# Altium project A1_v31.PrjPcb
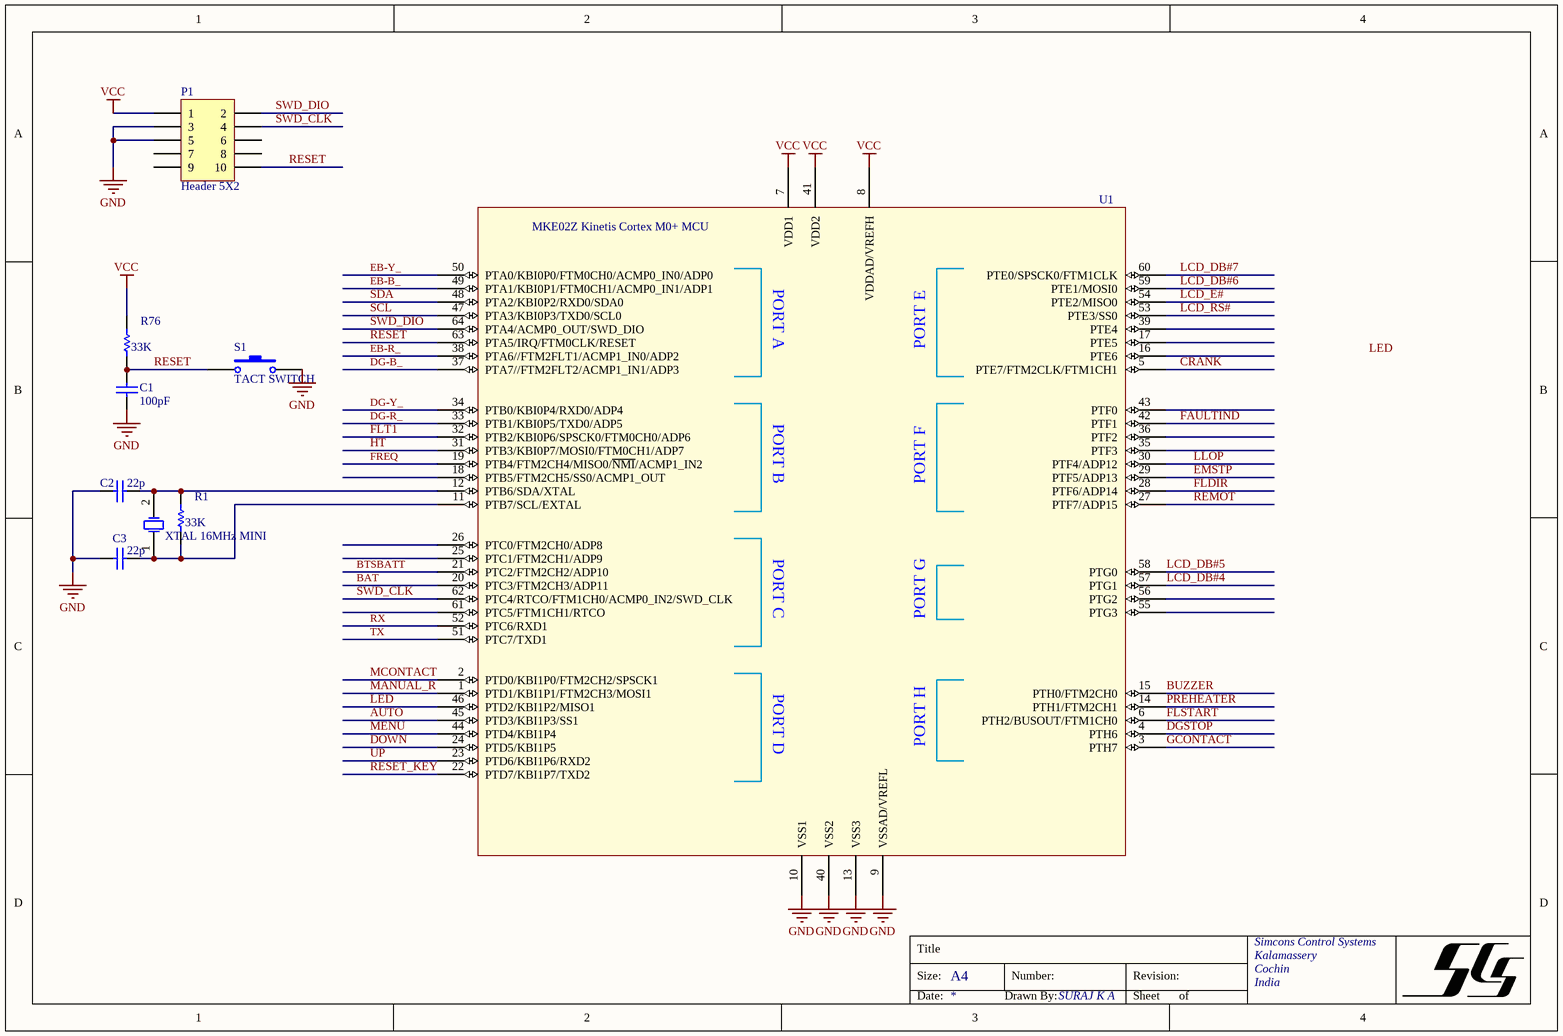
[diagram p0: arm_mcu.SchDoc]
4 sheets, 46 parts. Net scope: global (net labels, ports and power ports of the same name join across sheets).
Board file: A1_v31.PcbDoc
Sheets:
  arm_mcu.SchDoc
  DigitalIO.SchDoc
  PROCESSORv31.SchDoc
  IO_v31.SchDoc

## Sheet arm_mcu.SchDoc
size A4; Author: Suraj; DrawnBy: Suraj; Engineer: Suraj; Organization: Simcons Control Systems; Address1: Kalamassery; Address2: Cochin; Address4: India

### Parts
C1  value 100pF  [C1206_W]  (hidden comment: .1uF 1206)
C2  value 22p  [C1206_W]  (hidden comment: 22pF 1206)
C3  value 22p  [C1206_W]  (hidden comment: 22pF 1206)
P1  Header 5X2  [HDR2X5]
R1  value 33K  [R1206_W]  (hidden comment: 100K 1206)
R76  value 33K  [R1206_W]  (hidden comment: 100K 1206)
S1  TACT SWITCH  [SWSMALL]
U1  MKE02Z Kinetis Cortex M0+ MCU  [PLQP0064GA-A_M]
Y1  XTAL 16MHz MINI  [XTAL]

### Nets
GND: C1.1 C2.1 C3.1 P1.3 P1.5 S1.2 U1.9(VSSAD/VREFL) U1.10(VSS1) U1.13(VSS3) U1.40(VSS2)
VCC: P1.1 R76.1 U1.7(VDD1) U1.8(VDDAD/VREFH) U1.41(VDD2)
AUTO: U1.45(PTD3/KBI1P3/SS1)
BAT: U1.20(PTC3/FTM2CH3/ADP11)
BTSBATT: U1.21(PTC2/FTM2CH2/ADP10)
BUZZER: U1.15(PTH0/FTM2CH0)
CRANK: U1.5(PTE7/FTM2CLK/FTM1CH1)
DG-B_: U1.37(PTA7//FTM2FLT2/ACMP1_IN1/ADP3)
DG-R_: U1.33(PTB1/KBI0P5/TXD0/ADP5)
DG-Y_: U1.34(PTB0/KBI0P4/RXD0/ADP4)
DGSTOP: U1.4(PTH6)
DOWN: U1.24(PTD5/KBI1P5)
EB-B_: U1.49(PTA1/KBI0P1/FTM0CH1/ACMP0_IN1/ADP1)
EB-R_: U1.38(PTA6//FTM2FLT1/ACMP1_IN0/ADP2)
EB-Y_: U1.50(PTA0/KBI0P0/FTM0CH0/ACMP0_IN0/ADP0)
EMSTP: U1.29(PTF5/ADP13)
FAULTIND: U1.42(PTF1)
FLDIR: U1.28(PTF6/ADP14)
FLSTART: U1.6(PTH2/BUSOUT/FTM1CH0)
FLT1: U1.32(PTB2/KBI0P6/SPSCK0/FTM0CH0/ADP6)
FREQ: U1.19(PTB4/FTM2CH4/MISO0/~{NMI}/ACMP1_IN2)
GCONTACT: U1.3(PTH7)
HT: U1.31(PTB3/KBI0P7/MOSI0/FTM0CH1/ADP7)
LCD_DB#4: U1.57(PTG1)
LCD_DB#5: U1.58(PTG0)
LCD_DB#6: U1.59(PTE1/MOSI0)
LCD_DB#7: U1.60(PTE0/SPSCK0/FTM1CLK)
LCD_E#: U1.54(PTE2/MISO0)
LCD_RS#: U1.53(PTE3/SS0)
LED: U1.46(PTD2/KBI1P2/MISO1)
LLOP: U1.30(PTF4/ADP12)
MANUAL_R: U1.1(PTD1/KBI1P1/FTM2CH3/MOSI1)
MCONTACT: U1.2(PTD0/KBI1P0/FTM2CH2/SPSCK1)
MENU: U1.44(PTD4/KBI1P4)
PREHEATER: U1.14(PTH1/FTM2CH1)
REMOT: U1.27(PTF7/ADP15)
RESET: C1.2 P1.10 R76.2 S1.1 U1.63(PTA5/IRQ/FTM0CLK/RESET)
RESET_KEY: U1.22(PTD7/KBI1P7/TXD2)
RX: U1.52(PTC6/RXD1)
SCL: U1.47(PTA3/KBI0P3/TXD0/SCL0)
SDA: U1.48(PTA2/KBI0P2/RXD0/SDA0)
SWD_CLK: P1.4 U1.62(PTC4/RTCO/FTM1CH0/ACMP0_IN2/SWD_CLK)
SWD_DIO: P1.2 U1.64(PTA4/ACMP0_OUT/SWD_DIO)
TX: U1.51(PTC7/TXD1)
UP: U1.23(PTD6/KBI1P6/RXD2)
NetC2_2: C2.2 R1.1 U1.12(PTB6/SDA/XTAL) Y1.2(OSC2)
NetC3_2: C3.2 R1.2 U1.11(PTB7/SCL/EXTAL) Y1.1(OSC1)

Not connected (* = marked no-connect by the designer): P1 6 7 8 9; U1 16(PTE6) 17(PTE5) 18(PTB5/FTM2CH5/SS0/ACMP1_OUT) 25(PTC1/FTM2CH1/ADP9) 26(PTC0/FTM2CH0/ADP8) 35(PTF3) 36(PTF2) 39(PTE4) 43(PTF0) 55(PTG3) 56(PTG2) 61(PTC5/FTM1CH1/RTCO)

### Notes on the sheet
- Labels drawn without touching a wire or pin: LED
- Title
- Size:
- A4
- Number:
- Revision:
- Simcons Control Systems
- Kalamassery
- Cochin
- India
- Date:
- Drawn By:
- SURAJ K A
- Sheet
- of
- (in symbol MKE02Z64) PORT A; PORT E; PORT B; PORT F; PORT C; PORT G; PORT D; PORT H

### Library data of the parts
C1-C3 = Cap: Capacitor; Published: 8-Jun-2000; LatestRevisionDate: 17-Jul-2002; LatestRevisionNote: Re-released for DXP Platform.; PackageReference: RAD-0.3; Publisher: Altium Limited; PackageDescription: Radial Cap, Thru-Hole; 2 Leads; 0.3 in Pin Spacing
P1 = Header 5X2: Header, 5-Pin, Dual row; LatestRevisionDate: 17-Jul-2002; LatestRevisionNote: Re-released for DXP Platform.; Publisher: Altium Limited
R1 R76 = Res1: Resistor; Published: 8-Jun-2000; LatestRevisionDate: 17-Jul-2002; LatestRevisionNote: Re-released for DXP Platform.; PackageReference: AXIAL-0.4; Publisher: Altium Limited; PackageDescription: Axial Device, Thru-Hole; 2 Leads; 0.3 in Pin Spacing
S1 = SW-PB: Switch; Published: 24-Mar-1999; LatestRevisionDate: 17-Jul-2002; LatestRevisionNote: Re-released for DXP Platform.; PackageReference: SPST-2; Publisher: Altium Limited; PackageDescription: Switch; 2 Leads
U1 = MKE02Z64: 32-Bit ARM Cortex M0+ RISC Core, 64KB Program Flash, 256B EEPROM, 4KB RAM, 64-Pin LQFP
Y1 = XTAL: Crystal Oscillator; Published: 8-Jun-2000; LatestRevisionDate: 17-Jul-2002; LatestRevisionNote: Re-released for DXP Platform.; PackageReference: R38; Publisher: Altium Limited; PackageDescription: Crystal, Thru-Hole; 2 Leads; Body 3.1 x 8.2 mm (Dia.xH)

## Sheet DigitalIO.SchDoc
size A4; Author: Suraj; DrawnBy: Suraj; Engineer: Suraj; Organization: Simcons Control Systems; Address1: Kalamassery; Address2: Cochin; Address4: India
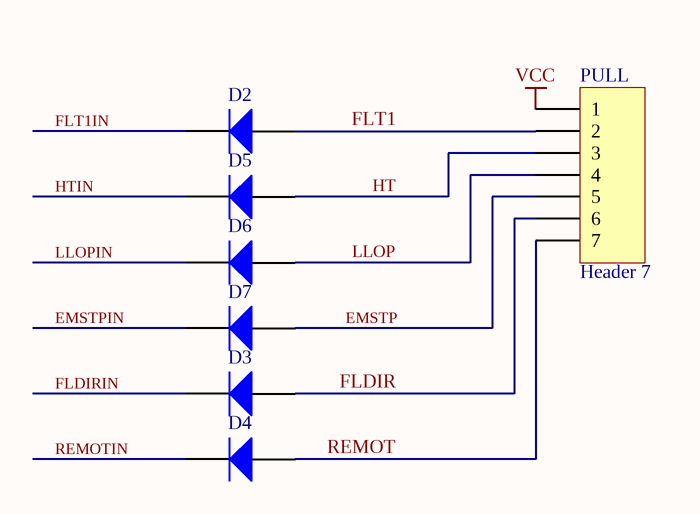
[diagram p1: DigitalIO.SchDoc]

### Parts
D2  Diode 1N4001  [4148SMD]  (value not drawn)
D3  Diode 1N4001  [4148SMD]  (value not drawn)
D4  Diode 1N4001  [4148SMD]  (value not drawn)
D5  Diode 1N4001  [4148SMD]  (value not drawn)
D6  Diode 1N4001  [4148SMD]  (value not drawn)
D7  Diode 1N4001  [4148SMD]  (value not drawn)
PULL  Header 7  [HDR1X7]

### Nets
VCC: PULL.1
EMSTP: D7.1(A) PULL.5
EMSTPIN: D7.2(K)
FLDIR: D3.1(A) PULL.6
FLDIRIN: D3.2(K)
FLT1: D2.1(A) PULL.2
FLT1IN: D2.2(K)
HT: D5.1(A) PULL.3
HTIN: D5.2(K)
LLOP: D6.1(A) PULL.4
LLOPIN: D6.2(K)
REMOT: D4.1(A) PULL.7
REMOTIN: D4.2(K)

### Notes on the sheet
- Title
- Size:
- A4
- Number:
- Revision:
- Simcons Control Systems
- Kalamassery
- Cochin
- India
- Date:
- Drawn By:
- SURAJ K A
- Sheet
- of

### Library data of the parts
D2-D7 = Diode 1N4001: 1 Amp General Purpose Rectifier; Published: 8-Jun-2000; LatestRevisionDate: 17-Jul-2002; LatestRevisionNote: Re-released for DXP Platform.; DatasheetVersion: 1998; PackageVersion: Aug-1999; PackageReference: DO-41; Publisher: Altium Limited; PackageDescription: Diode, Axial; Body 5.2 x 2.7 mm (LxDia. max), Lead Dia. 0.86 mm (max); Code_JEDEC: DO-204-AL; ComponentLink1Description: Manufacturer Link; ComponentLink1URL: http://www.fairchildsemi.com/; ComponentLink2Description: Datasheet; ComponentLink2URL: http://www.fairchildsemi.com/ds/1N%2F1N4001.pdf
PULL = Header 7: Header, 7-Pin; LatestRevisionDate: 17-Jul-2002; LatestRevisionNote: Re-released for DXP Platform.; Publisher: Altium Limited

## Sheet PROCESSORv31.SchDoc: AMF CONTROLLER GC12 v3.0
size A4; Date: MAR 2013; DrawnBy: SURAJ K A; Engineer: SURAJ K A; Revision: 310; SheetNumber: 1; SheetTotal: 2; DocumentName: AMFR
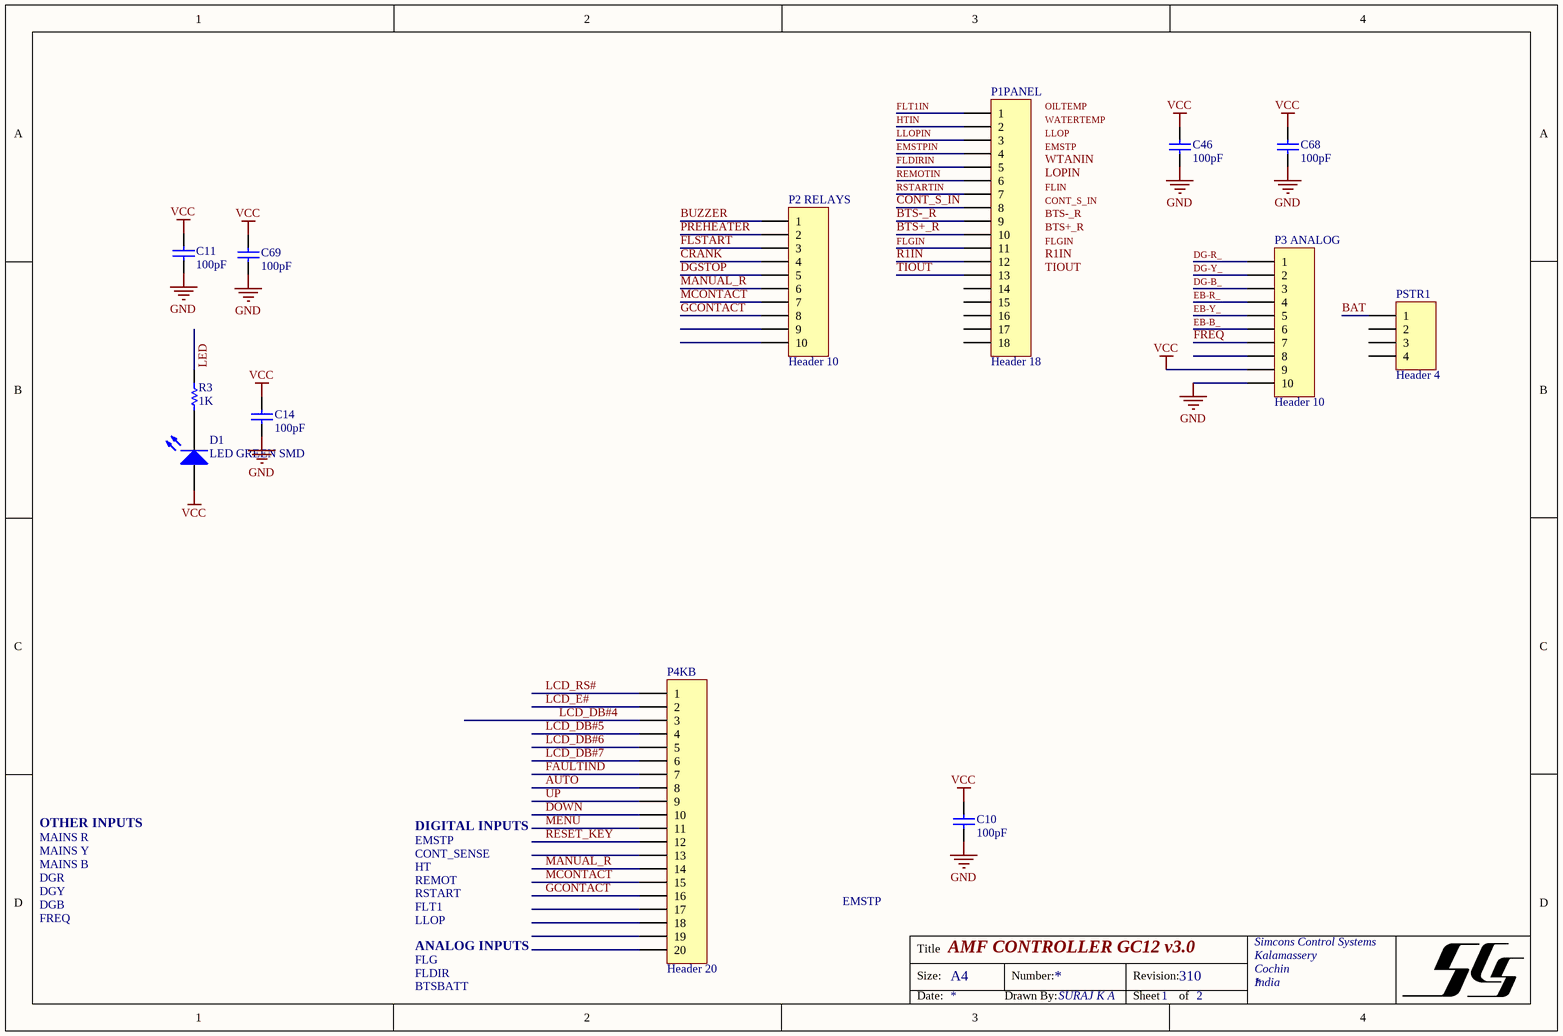
[diagram p2: PROCESSORv31.SchDoc]

### Parts
C10  value 100pF  [C1206_W]  (hidden comment: .1uF 1206)
C11  value 100pF  [C1206_W]  (hidden comment: 1uF 1206)
C14  value 100pF  [C1206_W]  (hidden comment: .1uF 1206)
C46  value 100pF  [C1206_W]  (hidden comment: .1uF 1206)
C68  value 100pF  [Cap_.1]  (hidden comment: 100uF/25V)
C69  value 100pF  [C1206_W]  (hidden comment: .1uF 1206)
D1  LED GREEN SMD  [LED SMD]
P1PANEL  Header 18  [HDR1X18_BURGE_F]
P2_RELAYS  Header 10  [HDR1X10_BURGE_F]
P3_ANALOG  Header 10  [HDR1X10_BURGE_F]
P4KB  Header 20  [HDR1X20_BURGE_F]
PSTR1  Header 4  [HDR1X4_BURGE_F]
R3  value 1K  [R1206_W]  (hidden comment: 1K 1206)

### Nets
GND: C10.1 C11.1 C14.1 C46.1 C68.2 C69.1 P3_ANALOG.10
VCC: C10.2 C11.2 C14.2 C46.2 C68.1 C69.2 D1.1(A) P3_ANALOG.9
AUTO: P4KB.8
BAT: PSTR1.1
BTS+_R: P1PANEL.10
BTS-_R: P1PANEL.9
BUZZER: P2_RELAYS.1
CONT_S_IN: P1PANEL.8
CRANK: P2_RELAYS.4
DG-B_: P3_ANALOG.3
DG-R_: P3_ANALOG.1
DG-Y_: P3_ANALOG.2
DGSTOP: P2_RELAYS.5
DOWN: P4KB.10
EB-B_: P3_ANALOG.6
EB-R_: P3_ANALOG.4
EB-Y_: P3_ANALOG.5
EMSTPIN: P1PANEL.4
FAULTIND: P4KB.7
FLDIRIN: P1PANEL.5
FLGIN: P1PANEL.11
FLSTART: P2_RELAYS.3
FLT1IN: P1PANEL.1
FREQ: P3_ANALOG.7
GCONTACT: P2_RELAYS.8 P4KB.16
HTIN: P1PANEL.2
LCD_DB#4: P4KB.3
LCD_DB#5: P4KB.4
LCD_DB#6: P4KB.5
LCD_DB#7: P4KB.6
LCD_E#: P4KB.2
LCD_RS#: P4KB.1
LED: R3.2
LLOPIN: P1PANEL.3
MANUAL_R: P2_RELAYS.6 P4KB.14
MCONTACT: P2_RELAYS.7 P4KB.15
MENU: P4KB.11
PREHEATER: P2_RELAYS.2
R1IN: P1PANEL.12
REMOTIN: P1PANEL.6
RESET_KEY: P4KB.12
RSTARTIN: P1PANEL.7
TIOUT: P1PANEL.13
UP: P4KB.9
NetD1_2: D1.2(K) R3.1

Not connected (* = marked no-connect by the designer): P1PANEL 14 15 16 17 18; P2_RELAYS 9 10; P3_ANALOG 8; P4KB 13 17 18 19 20; PSTR1 2 3 4

### Notes on the sheet
- OTHER INPUTS
- MAINS R
- MAINS Y
- DIGITAL INPUTS
- EMSTP
- CONT_SENSE
- MAINS B
- DGR
- DGY
- DGB
- FREQ
- HT
- REMOT
- RSTART
- FLT1
- LLOP
- ANALOG INPUTS
- FLG
- FLDIR
- BTSBATT
- Labels drawn without touching a wire or pin: BTS+_R, BTS-_R, CONT_S_IN, EMSTP, FLGIN, FLIN, LLOP, LOPIN, OILTEMP, R1IN, TIOUT, WATERTEMP, WTANIN
- Title
- Size:
- A4
- Number:
- Revision:
- Simcons Control Systems
- Kalamassery
- Cochin
- India
- Date:
- Drawn By:
- SURAJ K A
- Sheet
- of

### Library data of the parts
C10 C11 C14 C46 C68 C69 = Cap: Capacitor; Published: 8-Jun-2000; LatestRevisionDate: 17-Jul-2002; LatestRevisionNote: Re-released for DXP Platform.; PackageReference: RAD-0.3; Publisher: Altium Limited; PackageDescription: Radial Cap, Thru-Hole; 2 Leads; 0.3 in Pin Spacing
D1 = LED1: Typical RED GaAs LED; Published: 8-Jun-2000; LatestRevisionDate: 08-Jul-2005; LatestRevisionNote: Mech Layer 1 removed.; PackageReference: LED-1; Publisher: Altium Limited; PackageDescription: LED; 2 Leads
P1PANEL = Header 18: Header, 18-Pin; LatestRevisionDate: 17-Jul-2002; LatestRevisionNote: Re-released for DXP Platform.; Publisher: Altium Limited
P2_RELAYS P3_ANALOG = Header 10: Header, 10-Pin; LatestRevisionDate: 17-Jul-2002; LatestRevisionNote: Re-released for DXP Platform.; Publisher: Altium Limited
P4KB = Header 20: Header, 20-Pin; LatestRevisionDate: 17-Jul-2002; LatestRevisionNote: Re-released for DXP Platform.; Publisher: Altium Limited
PSTR1 = Header 4: Header, 4-Pin; LatestRevisionDate: 17-Jul-2002; LatestRevisionNote: Re-released for DXP Platform.; Publisher: Altium Limited
R3 = Res1: Resistor; Published: 8-Jun-2000; LatestRevisionDate: 17-Jul-2002; LatestRevisionNote: Re-released for DXP Platform.; PackageReference: AXIAL-0.3; Publisher: Altium Limited; PackageDescription: Axial Device, Thru-Hole; 2 Leads; 0.3 in Pin Spacing

## Sheet IO_v31.SchDoc: AMF CONTROLLER GC12
size A4; Date: NOV 2011; DrawnBy: SURAJ; Engineer: SURAJ K A; Revision: 310; SheetNumber: 2; SheetTotal: 2
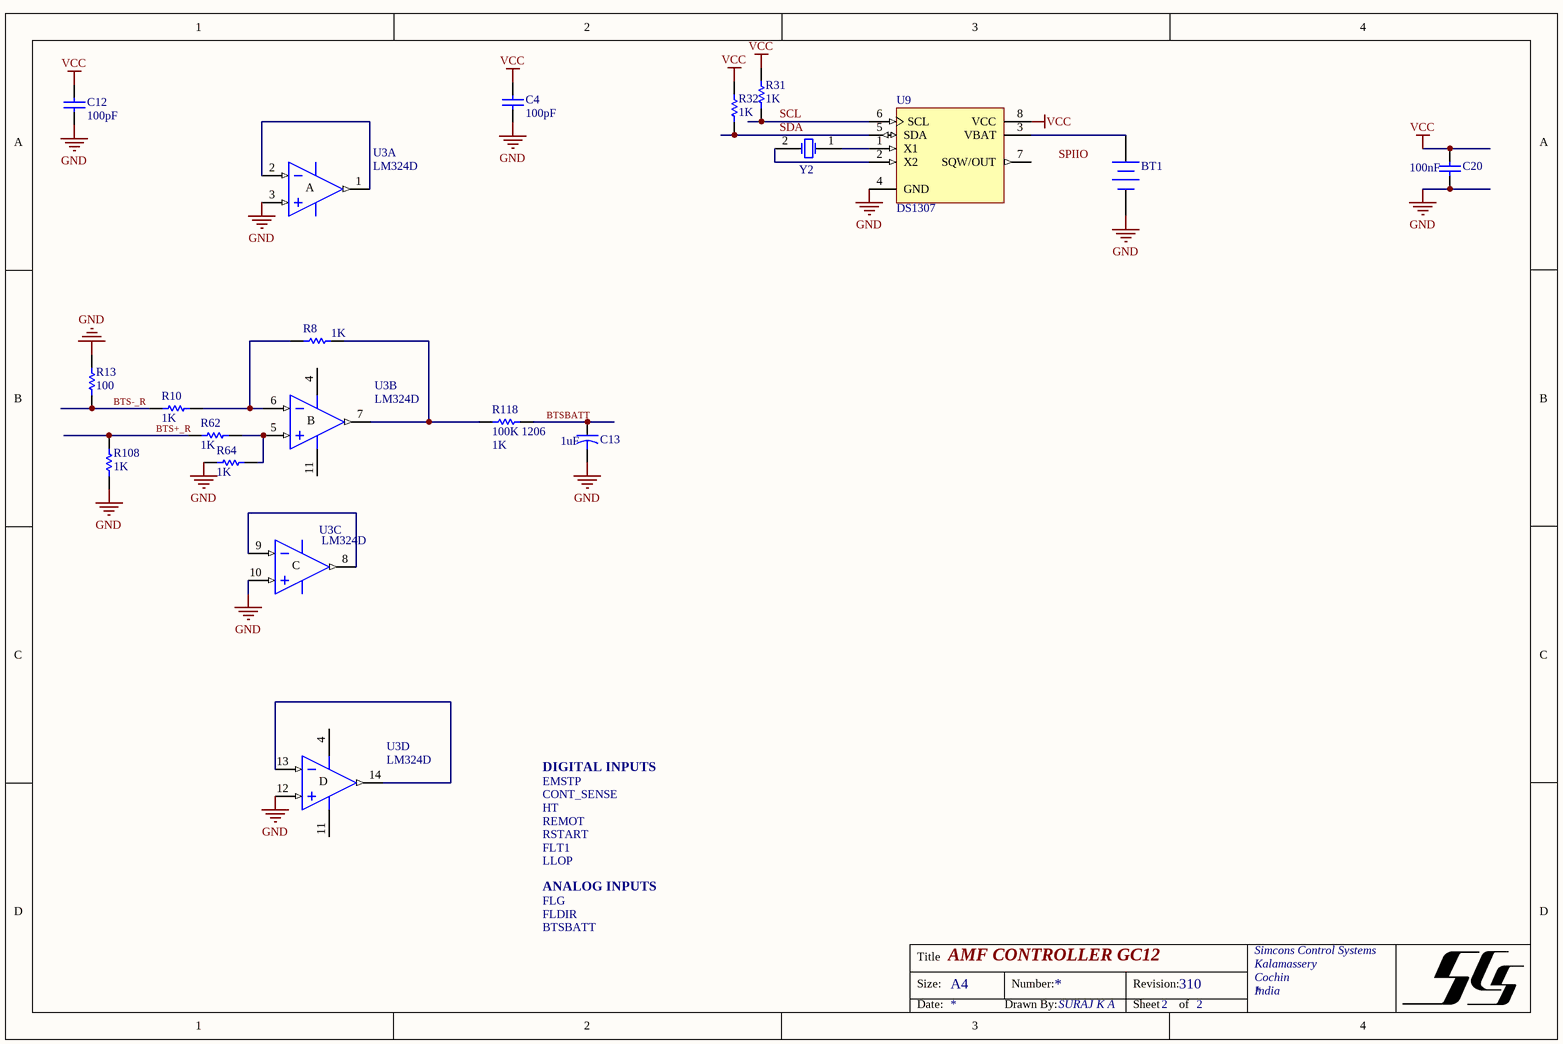
[diagram p3: IO_v31.SchDoc]

### Parts
BT1  CR2032  [CELL_HOLDER]  (value not drawn)
C4  value 100pF  [C1206_W]  (hidden comment: .1uF 1206)
C12  value 100pF  [C1206_W]  (hidden comment: .1uF 1206)
C13  value 1uF  [C1206_W]  (hidden comment: .1uF 1206)
C20  value 100nF  [C1206_W]  (hidden comment: .1uF 1206)
R8  value 1K  [R1206_W]  (hidden comment: 1M 1206)
R10  value 1K  [R1206_W]  (hidden comment: 1M 1206)
R13  value 100  [R1206_W]  (hidden comment: 47K 1206)
R31  value 1K  [R1206_W]  (hidden comment: 4.7K 1206)
R32  value 1K  [R1206_W]  (hidden comment: 4.7K 1206)
R62  value 1K  [R1206_W]  (hidden comment: 1M 1206)
R64  value 1K  [R1206_W]  (hidden comment: 1M 1206)
R108  value 1K  [R1206_W]  (hidden comment: 47K 1206)
R118  100K 1206  value 1K  [R1206_W]
U3  LM324D  [SOIC14_M]  (parts A,B,C,D of 4)
U9  DS1307  [DIP-8]
Y2  XTAL 32.768KHz 6pF  [XTALWATCH]  (value not drawn)

### Nets
GND: BT1.2(-) C4.1 C12.1 C13.2 C20.1 R13.1 R64.1 R108.1 U3.3(IN+) U3.10(IN+) U3.11(V-) U3.12(IN+) U9.4(GND)
VCC: C4.2 C12.2 C20.2 R31.1 R32.1 U3.4(V+) U9.8(VCC)
BTS+_R: R62.1 R108.2
BTS-_R: R10.1 R13.2
BTSBATT: C13.1 R118.2
SCL: R31.2 U9.6(SCL)
SDA: R32.2 U9.5(SDA)
NetBT1_1: BT1.1(+) U9.3(VBAT)
NetR8_1: R8.1 R10.2 U3.6(IN-)
NetR8_2: R8.2 R118.1 U3.7(OUT)
NetR62_2: R62.2 R64.2 U3.5(IN+)
NetU3_1: U3.1(OUT) U3.2(IN-)
NetU3_8: U3.8(OUT) U3.9(IN-)
NetU3_13: U3.13(IN-) U3.14(OUT)
NetU9_1: U9.1(X1) Y2.1(OSC1)
NetU9_2: U9.2(X2) Y2.2(OSC2)

Not connected (* = marked no-connect by the designer): U9 7(SQW/OUT)

### Notes on the sheet
- DIGITAL INPUTS
- EMSTP
- CONT_SENSE
- HT
- REMOT
- RSTART
- FLT1
- LLOP
- ANALOG INPUTS
- FLG
- FLDIR
- BTSBATT
- Labels drawn without touching a wire or pin: SPIIO
- Title
- Size:
- A4
- Number:
- Revision:
- Simcons Control Systems
- Kalamassery
- Cochin
- India
- Date:
- Drawn By:
- SURAJ K A
- Sheet
- of
- (in symbol LM324D, part A) A
- (in symbol LM324D, part B) B
- (in symbol LM324D, part C) C
- (in symbol LM324D, part D) D

### Library data of the parts
BT1 = Battery: Multicell Battery; Published: 24-Mar-1999; LatestRevisionDate: 17-Jul-2002; LatestRevisionNote: Re-released for DXP Platform.; PackageReference: BAT-2; Publisher: Altium Limited; PackageDescription: Battery; 2 Leads
C4 C12 C20 = Cap: Capacitor; Published: 8-Jun-2000; LatestRevisionDate: 17-Jul-2002; LatestRevisionNote: Re-released for DXP Platform.; PackageReference: RAD-0.3; Publisher: Altium Limited; PackageDescription: Radial Cap, Thru-Hole; 2 Leads; 0.3 in Pin Spacing
C13 = Cap2: Capacitor; Published: 23-Sep-2002; PackageReference: CAPR5-4X5; Publisher: Altium Limited; PackageDescription: Capacitor; 2 Leads
R8 R10 R13 R31 R32 R62 R64 R108 = Res1: Resistor; Published: 8-Jun-2000; LatestRevisionDate: 17-Jul-2002; LatestRevisionNote: Re-released for DXP Platform.; PackageReference: AXIAL-0.3; Publisher: Altium Limited; PackageDescription: Axial Device, Thru-Hole; 2 Leads; 0.3 in Pin Spacing
R118 = Res Semi: Semiconductor Resistor; Published: 8-Jun-2000; LatestRevisionDate: 17-Jul-2002; LatestRevisionNote: Re-released for DXP Platform.; PackageReference: AXIAL-0.5; Publisher: Altium Limited; PackageDescription: Axial Device, Thru-Hole; 2 Leads; 0.5 in Pin Spacing
U3 = LM324D: Quadruple Operational Amplifier; Published: 16-Jan-2001; LatestRevisionDate: 13-Apr-2006; LatestRevisionNote: IPC-7351 Footprint Added.; DatasheetVersion: Feb-1997; PackageVersion: Jan-1998; PackageReference: D014; Publisher: Altium Limited; PackageDescription: 14-Pin Small Outline Integrated Circuit 1.27 mm Pitch; Code_IPC: SOIC127P600-14; ComponentLink1Description: Manufacturer Link; ComponentLink1URL: http://www.ti.com/; ComponentLink2Description: Datasheet; ComponentLink2URL: http://www-s.ti.com/sc/ds/lm324.pdf
U9 = DS1307: 64 X 8 Serial Real-Time Clock; Published: 13-Oct-2000; LatestRevisionDate: 17-Jul-2002; LatestRevisionNote: Re-released for DXP Platform.; DatasheetVersion: 10-Aug-1999; PackageVersion: 1999; PackageReference: DIP8; Publisher: Altium Limited; PackageDescription: DIP, 8-Pin, Row Spacing 7.62 mm, Pitch 2.54 mm; ComponentLink1Description: Manufacturer Link; ComponentLink1URL: http://www.maxim-ic.com/; ComponentLink2Description: Datasheet; ComponentLink2URL: http://pdfserv.maxim-ic.com/en/ds/DS1307.pdf; ComponentLink3Description: Discontinuation Notice; ComponentLink3URL: http://www.maxim-ic.com/qa/pdfs/non-obsolescence-letter.pdf
Y2 = XTAL: Crystal Oscillator; Published: 8-Jun-2000; LatestRevisionDate: 17-Jul-2002; LatestRevisionNote: Re-released for DXP Platform.; PackageReference: R38; Publisher: Altium Limited; PackageDescription: Crystal, Thru-Hole; 2 Leads; Body 3.1 x 8.2 mm (Dia.xH)

## Nets that join several sheets
GND: arm_mcu (10 pins), PROCESSORv31 (7 pins), IO_v31 (13 pins)
VCC: arm_mcu (5 pins), DigitalIO (PULL.1), PROCESSORv31 (8 pins), IO_v31 (7 pins)
AUTO: arm_mcu (U1.45), PROCESSORv31 (P4KB.8)
BAT: arm_mcu (U1.20), PROCESSORv31 (PSTR1.1)
BTS+_R: PROCESSORv31 (P1PANEL.10), IO_v31 (R62.1 R108.2)
BTS-_R: PROCESSORv31 (P1PANEL.9), IO_v31 (R10.1 R13.2)
BTSBATT: arm_mcu (U1.21), IO_v31 (C13.1 R118.2)
BUZZER: arm_mcu (U1.15), PROCESSORv31 (P2_RELAYS.1)
CRANK: arm_mcu (U1.5), PROCESSORv31 (P2_RELAYS.4)
DG-B_: arm_mcu (U1.37), PROCESSORv31 (P3_ANALOG.3)
DG-R_: arm_mcu (U1.33), PROCESSORv31 (P3_ANALOG.1)
DG-Y_: arm_mcu (U1.34), PROCESSORv31 (P3_ANALOG.2)
DGSTOP: arm_mcu (U1.4), PROCESSORv31 (P2_RELAYS.5)
DOWN: arm_mcu (U1.24), PROCESSORv31 (P4KB.10)
EB-B_: arm_mcu (U1.49), PROCESSORv31 (P3_ANALOG.6)
EB-R_: arm_mcu (U1.38), PROCESSORv31 (P3_ANALOG.4)
EB-Y_: arm_mcu (U1.50), PROCESSORv31 (P3_ANALOG.5)
EMSTP: arm_mcu (U1.29), DigitalIO (D7.1 PULL.5)
EMSTPIN: DigitalIO (D7.2), PROCESSORv31 (P1PANEL.4)
FAULTIND: arm_mcu (U1.42), PROCESSORv31 (P4KB.7)
FLDIR: arm_mcu (U1.28), DigitalIO (D3.1 PULL.6)
FLDIRIN: DigitalIO (D3.2), PROCESSORv31 (P1PANEL.5)
FLSTART: arm_mcu (U1.6), PROCESSORv31 (P2_RELAYS.3)
FLT1: arm_mcu (U1.32), DigitalIO (D2.1 PULL.2)
FLT1IN: DigitalIO (D2.2), PROCESSORv31 (P1PANEL.1)
FREQ: arm_mcu (U1.19), PROCESSORv31 (P3_ANALOG.7)
GCONTACT: arm_mcu (U1.3), PROCESSORv31 (P2_RELAYS.8 P4KB.16)
HT: arm_mcu (U1.31), DigitalIO (D5.1 PULL.3)
HTIN: DigitalIO (D5.2), PROCESSORv31 (P1PANEL.2)
LCD_DB#4: arm_mcu (U1.57), PROCESSORv31 (P4KB.3)
LCD_DB#5: arm_mcu (U1.58), PROCESSORv31 (P4KB.4)
LCD_DB#6: arm_mcu (U1.59), PROCESSORv31 (P4KB.5)
LCD_DB#7: arm_mcu (U1.60), PROCESSORv31 (P4KB.6)
LCD_E#: arm_mcu (U1.54), PROCESSORv31 (P4KB.2)
LCD_RS#: arm_mcu (U1.53), PROCESSORv31 (P4KB.1)
LED: arm_mcu (U1.46), PROCESSORv31 (R3.2)
LLOP: arm_mcu (U1.30), DigitalIO (D6.1 PULL.4)
LLOPIN: DigitalIO (D6.2), PROCESSORv31 (P1PANEL.3)
MANUAL_R: arm_mcu (U1.1), PROCESSORv31 (P2_RELAYS.6 P4KB.14)
MCONTACT: arm_mcu (U1.2), PROCESSORv31 (P2_RELAYS.7 P4KB.15)
MENU: arm_mcu (U1.44), PROCESSORv31 (P4KB.11)
PREHEATER: arm_mcu (U1.14), PROCESSORv31 (P2_RELAYS.2)
REMOT: arm_mcu (U1.27), DigitalIO (D4.1 PULL.7)
REMOTIN: DigitalIO (D4.2), PROCESSORv31 (P1PANEL.6)
RESET_KEY: arm_mcu (U1.22), PROCESSORv31 (P4KB.12)
SCL: arm_mcu (U1.47), IO_v31 (R31.2 U9.6)
SDA: arm_mcu (U1.48), IO_v31 (R32.2 U9.5)
UP: arm_mcu (U1.23), PROCESSORv31 (P4KB.9)